# EAGLE design Qwiic_1.8V_Adapter (EAGLE 9.5.2)
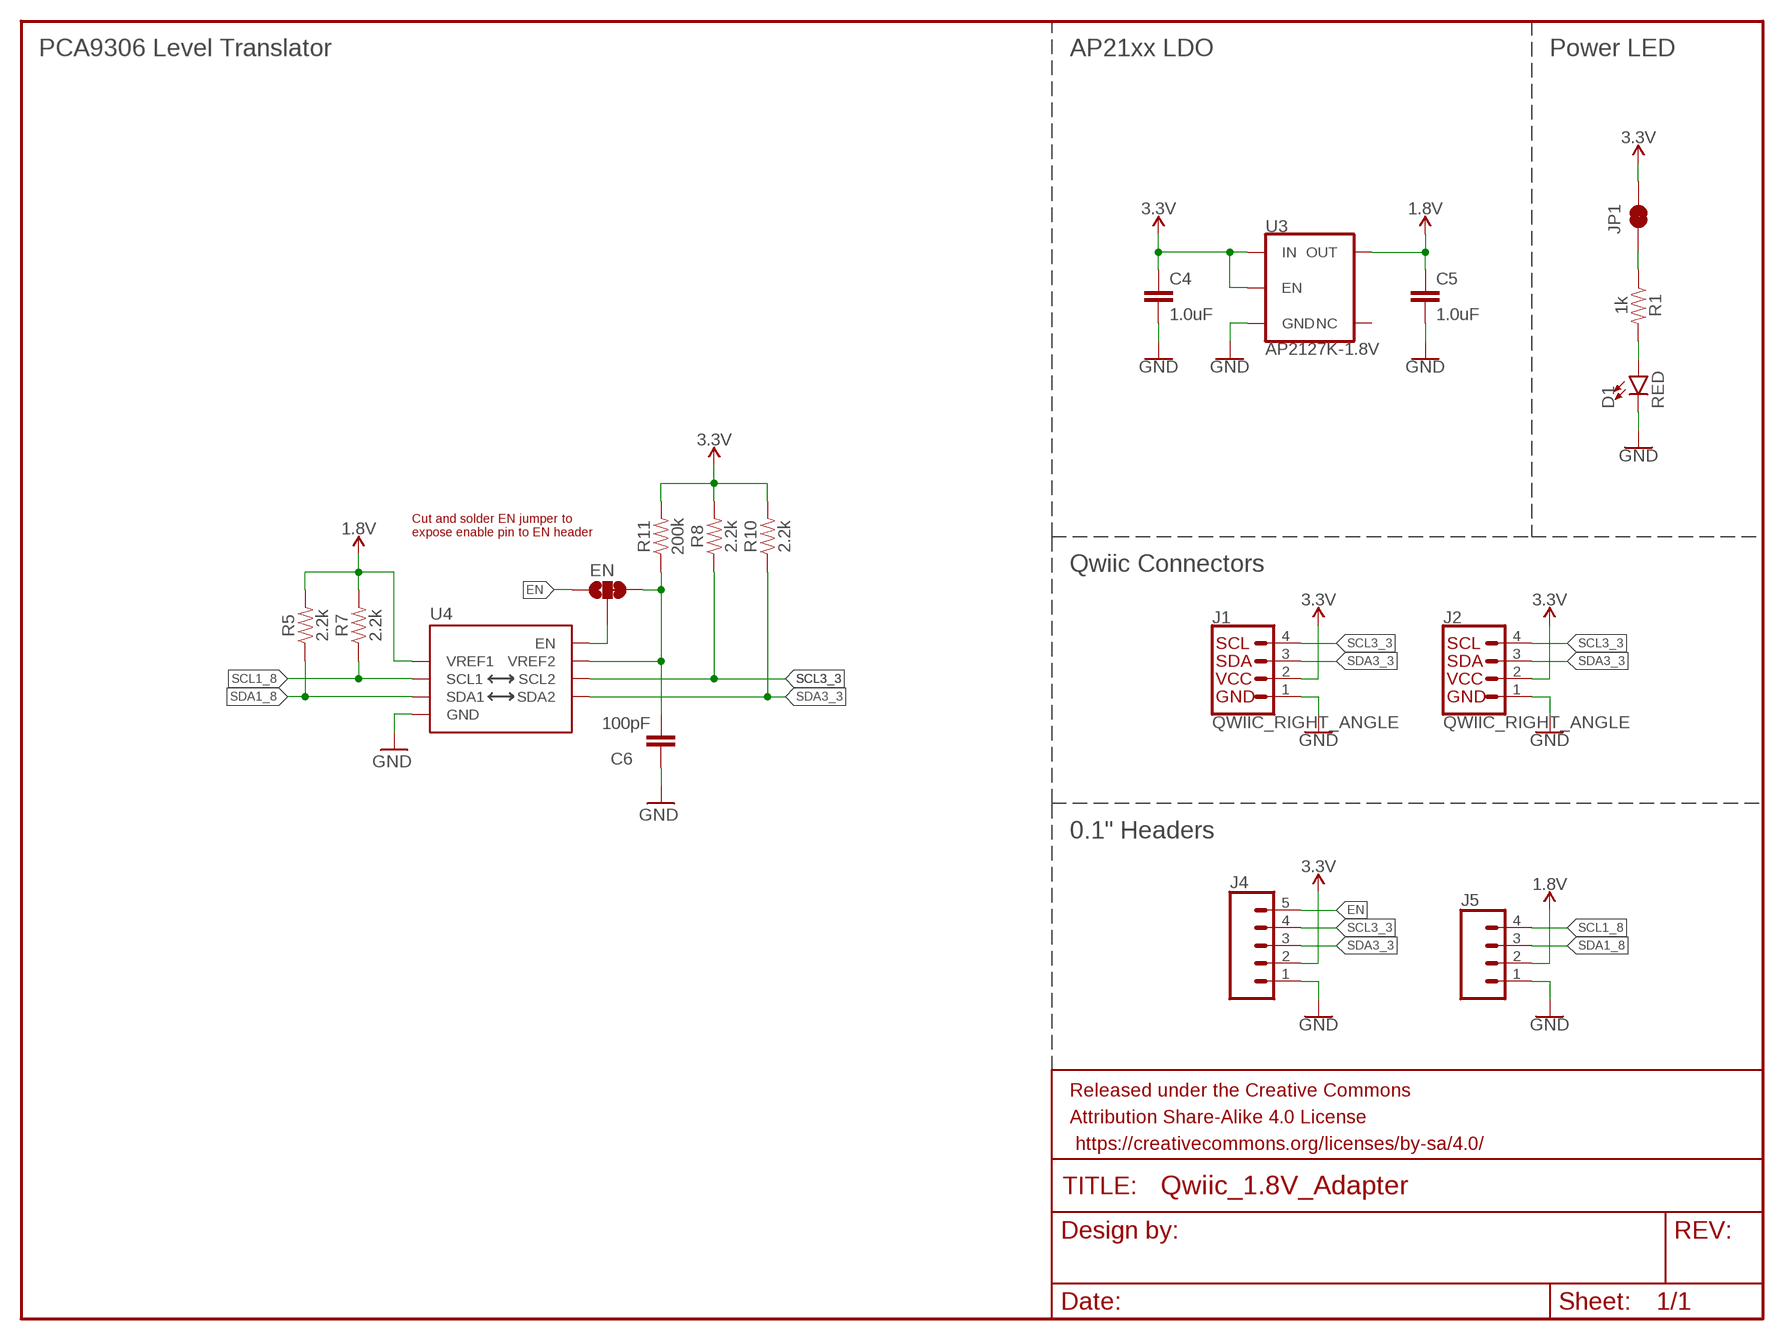
[diagram p0: schematic, sheet 1]

## Parts
C4  1.0uF  1.0UF-0603-16V-10%  [0603]
C5  1.0uF  1.0UF-0603-16V-10%  [0603]
C6  100pF  100PF-0603-50V-5%  [0603]
D1  RED  LED-RED0603  [LED-0603]
EN  JUMPER-SMT_3_1-NC_TRACE_SILK  [SMT-JUMPER_3_1-NC_TRACE_SILK]
FRAME1  FRAME-LETTER  [CREATIVE_COMMONS]
J1  QWIIC_RIGHT_ANGLE  QWIIC_CONNECTORJS-1MM  [JST04_1MM_RA]
J2  QWIIC_RIGHT_ANGLE  QWIIC_CONNECTORJS-1MM  [JST04_1MM_RA]
J4  CONN_05NO_SILK  [1X05_NO_SILK]
J5  CONN_041X04_NO_SILK  [1X04_NO_SILK]
JP1  JUMPER-SMT_2_NC_TRACE_SILK  [SMT-JUMPER_2_NC_TRACE_SILK]
R1  1k  1KOHM-0603-1/10W-1%  [0603]
R5  2.2k  2.2KOHM-0603-1/10W-1%  [0603]
R7  2.2k  2.2KOHM-0603-1/10W-1%  [0603]
R8  2.2k  2.2KOHM-0603-1/10W-1%  [0603]
R10  2.2k  2.2KOHM-0603-1/10W-1%  [0603]
R11  200k  200KOHM-0603-1/10W-1%  [0603]
U3  AP2127K-1.8V  V_REG_AP2127K-1.8V  [SOT23-5]
U4  PCA9306VSSOP_8PIN  [VSSOP_8PIN]

## Nets
1.8V: C5.1 J5.2 R5.2 R7.2 U3.5(OUT) U4.P2(VREF1)
3.3V: C4.1 J1.2 J2.2 J4.2 JP1.2 R8.2 R10.2 R11.2 U3.1(IN) U3.3(EN)
EN: EN.1 J4.5
GND: C4.2 C5.2 C6.1 D1.C J1.1 J2.1 J4.1 J5.1 U3.2(GND) U4.P1(GND)
N$1: EN.2 U4.P8(EN)
N$2: D1.A R1.2
N$3: JP1.1 R1.1
N$40: C6.2 EN.3 R11.1 U4.P7(VREF2)
SCL1_8: J5.4 R7.1 U4.P3(SCL1)
SCL3_3: J1.4 J2.4 J4.4 R8.1 U4.P6(SCL2)
SDA1_8: J5.3 R5.1 U4.P4(SDA1)
SDA3_3: J1.3 J2.3 J4.3 R10.1 U4.P5(SDA2)
Unconnected: U3.4(NC)

## Notes on the sheet
- PCA9306 Level Translator | AP21xx LDO | Power LED
- Cut and solder EN jumper to 
  expose enable pin to EN header
- Qwiic Connectors
- 0.1" Headers

## Library data of the parts
C4 C5 = SparkFun-Capacitors:1.0UF: 1µF ceramic capacitors A capacitor is a passive two-terminal electrical component used to store electrical energy temporarily in an electric field.; PROD_ID: CAP-00868
C6 = SparkFun-Capacitors:100PF: 100pF/0.1nF ceramic capacitors A capacitor is a passive two-terminal electrical component used to store electrical energy temporarily in an electric field.; PROD_ID: CAP-07883
D1 = SparkFun-LED:LED-RED: Red SMD LED Used in manufacturing of most products at SparkFun Packages: 0603 - SMD 0603 package [Product Link] <http://docs.avagotech.com/docs/AV02-0551EN> 0603 SMART - SMD 0603 SMART package ( more efficient and expensive)[Product Link] <http://www.osram-os.com/Graphics/XPic2/00077099_0.pdf> 1206 - SMD1206 package [Product Link] <https://www.sparkfun.com/datasheets/DevTools/LilyPad/Q150OVS4.pdff> SparkFun Products: Pro Mini 328 -5V <https://www.sparkfun.com/products/821> RedBoard <https://www.sparkfun.com/products/12757> IOIO-OTG <https://www.sparkfun.com/products/13613>; PROD_ID: DIO-00819
EN = SparkFun-Jumpers:JUMPER-SMT_3_1-NC_TRACE: Normally closed trace jumper (1 of 2 connections) This jumper has a trace between two pads so it's normally closed (NC). The other connection is normally open (NO). Use a razor knife to open the connection. For best results follow the IPC guidelines for cutting traces: Cutout at least 0.063 mm (0.005 in). Remove all loose material to clean up the cut area. Seal the cut with an approved epoxy. Reapply solder to reclose the connection, or to close the NO connection.
FRAME1 = SparkFun-Aesthetics:FRAME-LETTER: Schematic Frame - Letter Standard 8.5x11 US Letter frame
J1 J2 = SparkFun-Connectors:QWIIC_CONNECTOR: SparkFun I2C Standard Qwiic Connector An SMD 1mm pitch JST connector makes it easy and quick (get it? Qwiic?) to connect I2C devices to each other. The Qwiic system <http://www.sparkfun.com/qwiic> enables fast and solderless connection between popular platforms and various sensors and actuators. We carry 200mm <https://www.sparkfun.com/products/14204>, 100mm <https://www.sparkfun.com/products/14205>, 50mm <https://www.sparkfun.com/products/14206>, and breadboard friendly <https://www.sparkfun.com/products/14207> Qwiic cables. We also offer 10 pcs strips <https://www.sparkfun.com/products/14323> the SMD connectors.; PROD_ID: CONN-13694
J4 = SparkFun-Connectors:CONN_05: Multi connection point. Often used as Generic Header-pin footprint for 0.1 inch spaced/style header connections On any of the 0.1 inch spaced packages, you can populate with these: Break Away Headers - Straight <https://www.sparkfun.com/products/116> (PRT-00116) Break Away Male Headers - Right Angle <https://www.sparkfun.com/products/553> (PRT-00553) Female Headers <https://www.sparkfun.com/products/115> (PRT-00115) Break Away Headers - Machine Pin <https://www.sparkfun.com/products/117> (PRT-00117) Break Away Female Headers - Swiss Machine Pin <https://www.sparkfun.com/products/743> (PRT-00743) For SCREWTERMINALS and SPRING TERMINALS visit here: Screw Terimnals on SparkFun.com <https://www.sparkfun.com/search/results?term=Screw+Terminals> (5mm/3.5mm/2.54mm spacing) This device is also useful as a general connection point to wire up your design to another part of your project. Our various solder wires solder well into these plated through hole pads. Hook-Up Wire - Assortment (Stranded, 22 AWG) <https://www.sparkfun.com/products/11375> (PRT-11375) Hook-Up Wire - Assortment (Solid Core, 22 AWG) <https://www.sparkfun.com/products/11367> (PRT-11367) View the entire wire category on our website here <https://www.sparkfun.com/categories/141> Special notes: Molex polarized connector foot print use with SKU : PRT-08231 with associated crimp pins and housings. 1MM SMD Version SKU: PRT-10208
J5 = SparkFun-Connectors:CONN_04: Multi connection point. Often used as Generic Header-pin footprint for 0.1 inch spaced/style header connections On any of the 0.1 inch spaced packages, you can populate with these: Break Away Headers - Straight <https://www.sparkfun.com/products/116> (PRT-00116) Break Away Male Headers - Right Angle <https://www.sparkfun.com/products/553> (PRT-00553) Female Headers <https://www.sparkfun.com/products/115> (PRT-00115) Break Away Headers - Machine Pin <https://www.sparkfun.com/products/117> (PRT-00117) Break Away Female Headers - Swiss Machine Pin <https://www.sparkfun.com/products/743> (PRT-00743) For SCREWTERMINALS and SPRING TERMINALS visit here: Screw Terimnals on SparkFun.com <https://www.sparkfun.com/search/results?term=Screw+Terminals> (5mm/3.5mm/2.54mm spacing) This device is also useful as a general connection point to wire up your design to another part of your project. Our various solder wires solder well into these plated through hole pads. Hook-Up Wire - Assortment (Stranded, 22 AWG) <https://www.sparkfun.com/products/11375> (PRT-11375) Hook-Up Wire - Assortment (Solid Core, 22 AWG) <https://www.sparkfun.com/products/11367> (PRT-11367) View the entire wire category on our website here <https://www.sparkfun.com/categories/141> Special notes: Molex polarized connector foot print use with SKU : PRT-08231 with associated crimp pins and housings. 1MM SMD Version SKU: PRT-10208; PROD_ID: CONN-09696
JP1 = SparkFun-Jumpers:JUMPER-SMT_2_NC_TRACE: Normally closed trace jumper This jumper has a trace between two pads so it's normally closed (NC). Use a razor knife to open the connection. For best results follow the IPC guidelines for cutting traces: Cutout at least 0.063 mm (0.005 in). Remove all loose material to clean up the cut area. Seal the cut with an approved epoxy. Reapply solder to reclose the connection.
R1 = SparkFun-Resistors:1KOHM: 1kΩ resistor A resistor is a passive two-terminal electrical component that implements electrical resistance as a circuit element. Resistors act to reduce current flow, and, at the same time, act to lower voltage levels within circuits. - Wikipedia; PROD_ID: RES-07856
R5 R7 R8 R10 = SparkFun-Resistors:2.2KOHM: 2.2kΩ resistor A resistor is a passive two-terminal electrical component that implements electrical resistance as a circuit element. Resistors act to reduce current flow, and, at the same time, act to lower voltage levels within circuits. - Wikipedia; PROD_ID: RES-08272
R11 = SparkFun-Resistors:200KOHM: 200kΩ resistor A resistor is a passive two-terminal electrical component that implements electrical resistance as a circuit element. Resistors act to reduce current flow, and, at the same time, act to lower voltage levels within circuits. - Wikipedia; PROD_ID: RES-09385
U3 = SparkFun-IC-Power:V_REG_AP2127: AP2127 - 300mA CMOS LDO Regulator w/ Enable The AP2127 is CMOS process low dropout linear regulator with enable function, the regulator delivers a guaranteed 300mA (min.) continuous load current. Features Output Voltage Accuracy: ±1.5% Output Current: 300mA (Min.) Foldback Short Current Protection: 50mA Enable Function to Turn ON/OFF VOUT Low Dropout Voltage (3.3V): 250mV (Typ.) @IOUT=600mA Excellent Load Regulation: 0.2%/A (Typ.) Excellent Line Regulation: 0.02%/V (Typ.) Low Quiescent Current: 55μA (Typ.) Low Standby Current: 0.01μA (Typ.) Low Output Noise: 50μVRMS PSRR: 100Hz -65dB, 1kHz -65dB OTSD Protection Stable with 1.0μF Flexible Cap: Ceramic, Tantalum and Aluminum Electrolytic Operation Temperature Range: -40°C to 85°C ESD: MM 400V, HBM 4000V; PROD_ID: VREG-14239
U4 = SparkFun-IC-Comms:PCA9306: Bidirectional I2C level shifter Not compatible with all available part number pinout schemes- DOUBLE CHECK!!! Variants PCA9306DC and PSOP-8 are EOL. If your part has VREF as pin 1 then this is your variant. VSSOP_8PIN is not EOL. Datasheet <https://cdn.sparkfun.com/datasheets/BreakoutBoards/PCA9306DC.pdf> SparkFun Products SparkFun Inventor's Kit for RedBot <https://www.sparkfun.com/products/12649> (ROB-12649) SparkFun RedBot Basic Kit <https://www.sparkfun.com/products/13166> (ROB-13166) SparkFun Level Translator Breakout - PCA9306 <https://www.sparkfun.com/products/11955> (BOB-11955) SparkFun Block for Intel Edison - ADC <https://www.sparkfun.com/products/13770> (DEV-13770) SparkFun Block for Intel® Edison - Raspberry Pi B <https://www.sparkfun.com/products/13044> (DEV-13044) SparkFun RedBot Sensor - Accelerometer <https://www.sparkfun.com/products/12589> (SEN-12589); PROD_ID: IC-14450

## Board
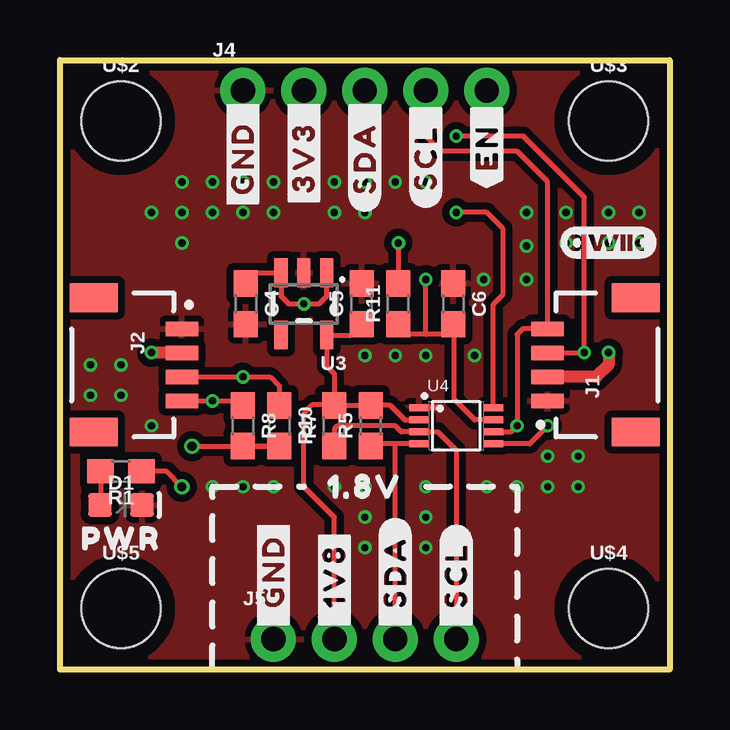
[diagram p1: board, top side]
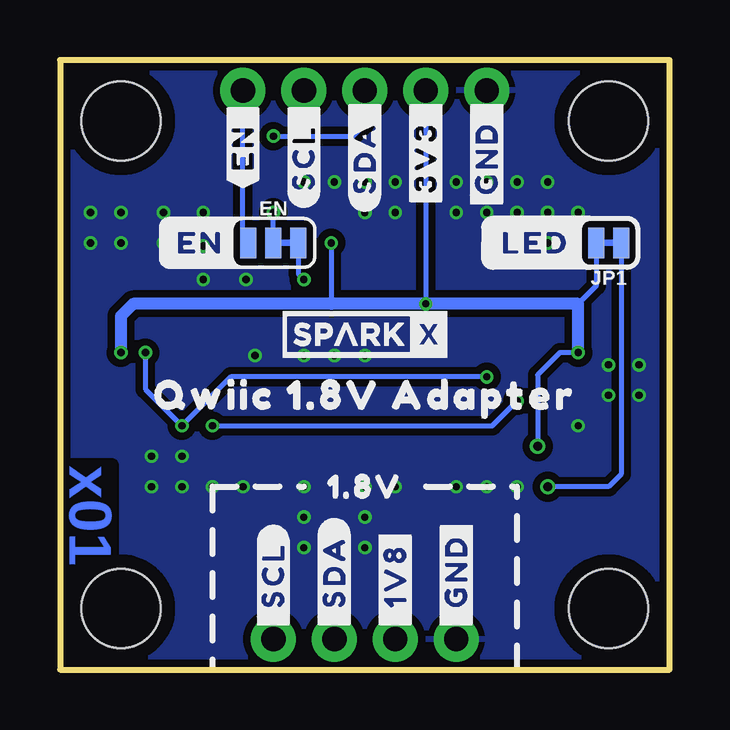
[diagram p2: board, bottom side, seen from below]

Size 25.4 x 25.4 mm. Coordinates in mm from the lower left corner, seen from the top.
Outline: 0,0 0,25.4 25.4,25.4 25.4,0 0,0
Copper layers (1*16): Top 0.035mm / dielectric 1.5mm / Bottom 0.035mm
Design rules "SparkFun-2-Layer-Minimum-JLCPCB": minimum track width 5mil, minimum drill 0.3mm, track to track 5mil, track to pad 5mil, pad to pad 5mil, via to via 5mil, smd to smd 5mil, copper to edge 7mil, drill to drill 7mil, minimum pad ring 5mil, minimum via ring 5mil, stop-mask expansion 4mil, vias tented up to drill 25mil, thermal gap 10mil

### Footprints (pad centres in the part's own frame; a part is rotated, then mirrored left to right if it is on the bottom)
0603 = smd 1.1 x 1: 1 -0.85,0; 2 0.85,0
LED-0603 = smd 1 x 1: A -0.877,0; C 0.877,0
SMT-JUMPER_3_1-NC_TRACE_SILK = smd 0.66 x 1.27: 1 -1.041,0; 2 0,0; 3 1.041,0
JST04_1MM_RA = smd 0.6 x 1.35: 1 -1.5,0; 2 -0.5,0; 3 0.5,0; 4 1.5,0 | smd 1.2 x 2: NC1 2.8,-3.675; NC2 -2.8,-3.675
1X05_NO_SILK = drill 1.016 pad 1.88: 1 0,0; 2 2.54,0; 3 5.08,0; 4 7.62,0; 5 10.16,0
1X04_NO_SILK = drill 1.016 pad 1.88: 1 0,0; 2 2.54,0; 3 5.08,0; 4 7.62,0
SMT-JUMPER_2_NC_TRACE_SILK = smd 0.66 x 1.27: 1 -0.521,0; 2 0.521,0
SOT23-5 = smd 0.55 x 1.2: 1 -0.95,-1.3; 2 0,-1.3; 3 0.95,-1.3; 4 0.95,1.3; 5 -0.95,1.3
VSSOP_8PIN = smd 0.8 x 0.3: P1 -1.55,0.75; P2 -1.55,0.25; P3 -1.55,-0.25; P4 -1.55,-0.75; P5 1.55,-0.75; P6 1.55,-0.25; P7 1.55,0.25; P8 1.55,0.75
STAND-OFF = hole 3.302: 0,0

### Placement (x,y rotation side)
C4  7.75,15.24 270 top
C5  12.57,15.24 90 top
C6  16.38,15.24 270 top
D1  2.54,6.86 0 top
EN  16.51,17.78 0 bottom
FRAME1  -10.16,-10.16 0 top  (outside the outline)
J1  20.32,12.7 90 top
J2  5.08,12.7 270 top
J4  7.62,24.13 0 top
J5  8.89,1.27 0 top
JP1  2.54,17.78 180 bottom
R1  2.54,8.26 180 top
R5  12.95,10.16 90 top
R7  11.43,10.16 90 top
R8  7.62,10.16 270 top
R10  9.14,10.16 270 top
R11  14.1,15.24 90 top
U3  10.16,15.24 180 top
U4  16.51,10.16 0 top
U$1  [#_GND#0]  8.89,1.52 90 top
U$2  [STAND-OFF]  2.54,22.86 0 top
U$3  [STAND-OFF]  22.86,22.86 0 top
U$4  [STAND-OFF]  22.86,2.54 0 top
U$5  [STAND-OFF]  2.54,2.54 0 top
U$6  [#_1V8#0]  11.43,1.52 90 top
U$7  [#_SDA#0]  13.97,1.52 90 top
U$8  [#_SCL#0]  16.51,1.52 90 top
U$9  [PWR0]  2.54,5.46 0 top
U$10  [#GND_#0]  7.62,23.88 90 top
U$11  [#3V3_#0]  10.16,23.88 90 top
U$12  [#SDA_#0]  12.7,23.88 90 top
U$13  [#SCL_#0]  15.24,23.75 90 top
U$14  [#EN_#0]  17.78,23.75 90 top
U$15  [1#8V0]  12.7,7.62 0 top
U$16  [QWIIC_4MM]  22.86,17.78 0 top
U$17  [#_GND#0]  8.89,1.52 90 bottom
U$18  [#_1V8#0]  11.43,1.52 90 bottom
U$19  [#_SDA#0]  13.97,1.52 90 bottom
U$20  [#_SCL#0]  16.51,1.52 90 bottom
U$21  [#GND_#0]  7.62,23.88 90 bottom
U$22  [#3V3_#0]  10.16,23.88 90 bottom
U$23  [#SDA_#0]  12.7,23.88 90 bottom
U$24  [#SCL_#0]  15.24,23.75 90 bottom
U$25  [#EN_#0]  17.78,23.75 90 bottom
U$26  [1#8V0]  12.7,7.62 0 bottom
U$27  [#EN#0]  19.56,17.78 0 bottom
U$28  [QWIIC_1#8V_ADAPTER0]  12.7,11.43 0 bottom
U$29  [SPARKX-SMALL]  12.7,13.97 0 bottom
U$30  [#LED#0]  5.59,17.78 0 bottom

### Tracks (layer width: path | path; a pad name or v marks a point on that pad's centre or on a via)
1.8V
  Top 0.203: U4.P2 14.36,10.41 13.76,11.01 R5.2 R7.2 | C5.1 12.12,13.94 U3.5 11.11,12.64 11.43,12.32 R7.2 | J5.2 11.43,6.35 10.16,7.62 10.16,10.67 10.54,11.05 11.39,11.05 R7.2
3.3V  (via drill 0.3, 0.38)
  Top 0.203: R8.2 R10.2 v5.5,9.31 | C4.1 8.2,16.54 U3.3 9.21,15.55 9.53,15.24 v10.16,15.24 10.79,15.24 11.11,15.55 U3.1 | v14.1,17.78 R11.2
  Top 0.508: v22.86,13.21 22.86,12.7 22.35,12.19 J1.2 | J2.2 v3.82,13.2 v3.81,13.21
  Bottom 0.203: v14.1,17.78 14.1,15.24 | J4.2 v10.16,15.24 | v3.81,13.21 4.57,13.21 5.5,12.28 v5.5,9.31 | JP1.2 3.06,15.99 3.81,15.24
  Bottom 0.508: v3.81,13.21 3.81,15.24 v10.16,15.24 14.1,15.24 22.35,15.24 22.86,14.73 v22.86,13.21
EN
  Bottom 0.203: EN.1 17.78,18.01 J4.5
GND  (via drill 0.3)
  Top 0.254: U4.P1 14.97,10.92 15.88,10.92
  other vias: 17.65,16.26 17.27,13.08 19.43,16.26 19.43,17.65 19.43,19.05 12.7,13.08 13.97,13.08 15.24,13.08 17.78,7.62 19.05,7.62 20.32,7.62 22.86,19.05 22.86,17.78 24.13,17.78 24.13,19.05 15.24,7.62 15.24,6.35 15.24,5.08 12.7,7.62 11.43,7.62 12.7,6.35 12.7,5.08 11.43,20.32 12.7,20.32 11.43,19.05 12.7,19.05 13.97,20.32 15.24,20.32 21.08,19.05 21.08,17.78 8.89,20.32 8.89,19.05 7.62,19.05 7.62,20.32 6.35,20.32 5.08,20.32 3.81,19.05 5.08,17.78 5.08,19.05 6.35,19.05 20.32,8.89 21.59,8.89 21.59,7.62 8.89,7.62 7.62,7.62 6.35,7.62 3.81,10.16 2.54,11.43 2.54,12.7 1.27,12.7 1.27,11.43
  pour Top (isolate 0.305): 0,25.4 25.4,25.4 25.4,0 0,0
  pour Bottom (isolate 0.305): 0,25.4 25.4,25.4 25.4,0 0,0
N$1  (via drill 0.3)
  Top 0.203: v16.51,19.05 17.78,19.05 18.44,18.39 18.44,15.61 18.06,15.23 U4.P8
  Bottom 0.203: EN.2 v16.51,19.05
N$2
  Top 0.203: R1.2 1.69,6.88 D1.A
N$3  (via drill 0.38)
  Top 0.203: v5.08,7.62 4.45,8.26 R1.1
  Bottom 0.203: JP1.1 2.02,8.14 2.54,7.62 v5.08,7.62
N$40  (via drill 0.3)
  Top 0.203: 16.43,14.31 16.09,13.97 15.24,13.97 | C6.2 16.43,14.43 16.43,14.31 | 15.24,13.97 14.52,13.97 R11.1 | U4.P7 17.28,10.41 16.43,11.26 16.43,14.31 | 15.24,13.97 v15.24,16.26
  Bottom 0.203: EN.3 15.47,16.48 v15.24,16.26
SCL1_8
  Top 0.203: J5.4 16.51,9.14 15.74,9.91 U4.P3 14.22,9.91 13.97,10.16 11.56,10.16 11.43,10.03 R7.1
SCL3_3  (via drill 0.3)
  Top 0.203: J2.4 v6.35,11.2 7.43,11.2 R8.1 | U4.P6 18.8,9.91 v19.05,10.16 19.05,13.97 19.28,14.2 J1.4 20.32,20.32 19.05,21.59 15.88,21.59 15.24,22.23 J4.4
  Bottom 0.203: v19.05,10.16 7.39,10.16 v6.35,11.2
SDA1_8
  Top 0.203: U4.P4 13.97,9.41 | 13.97,9.41 13.05,9.41 R5.1 | J5.3 13.97,9.41
SDA3_3  (via drill 0.3)
  Top 0.203: J2.3 v7.62,12.2 8.76,12.2 9.14,11.81 R10.1 | v20.32,10.16 19.57,9.41 U4.P5 | J1.3 v21.84,13.2 v21.84,13.21 21.84,19.68 19.3,22.23 v16.51,22.23
  Bottom 0.203: v7.62,12.2 18.28,12.2 v20.32,10.16 21.84,11.68 v21.84,13.21 | v16.51,22.23 13.21,22.23 12.7,22.73 J4.3

### Text on the board
Bottom: x01
tDocu: NPoole